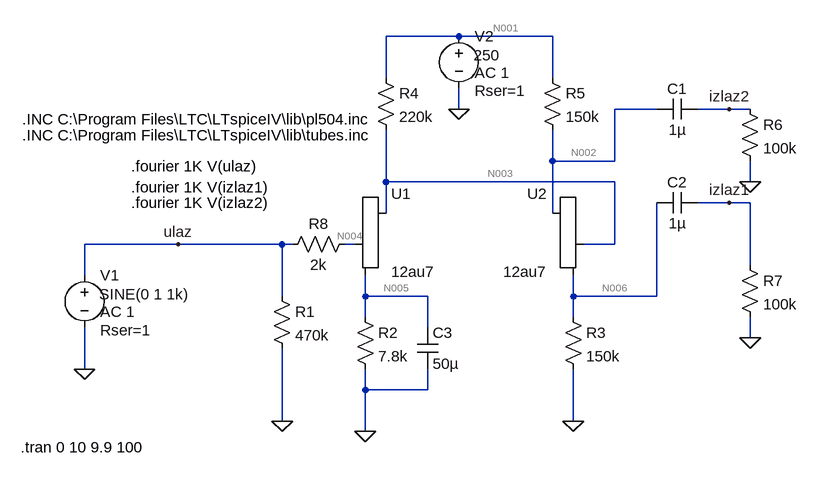
[diagram p0: schematic paraprase.asc]
paraprase.asc, the LTspice schematic file:
Version 4
SHEET 1 880 680
WIRE 240 -144 128 -144
WIRE 384 -144 240 -144
WIRE 128 -80 128 -144
WIRE 384 -80 384 -144
WIRE 240 -32 240 -64
WIRE 544 -32 480 -32
WIRE 656 -32 608 -32
WIRE 688 -32 656 -32
WIRE 384 48 384 0
WIRE 480 48 480 -32
WIRE 480 48 384 48
WIRE 128 80 128 0
WIRE 480 80 128 80
WIRE 688 80 688 48
WIRE 656 112 608 112
WIRE 688 112 656 112
WIRE 128 128 128 80
WIRE 384 128 384 48
WIRE -192 176 -336 176
WIRE -32 176 -192 176
WIRE -16 176 -32 176
WIRE 80 176 64 176
WIRE 480 176 480 80
WIRE 480 176 432 176
WIRE 688 208 688 112
WIRE -336 224 -336 176
WIRE -32 256 -32 176
WIRE 96 256 96 224
WIRE 192 256 96 256
WIRE 416 256 416 224
WIRE 544 256 544 112
WIRE 544 256 416 256
WIRE 96 288 96 256
WIRE 416 288 416 256
WIRE 192 304 192 256
WIRE 688 320 688 288
WIRE -336 368 -336 304
WIRE 96 400 96 368
WIRE 192 400 192 368
WIRE 192 400 96 400
WIRE -32 448 -32 336
WIRE 416 448 416 368
WIRE 96 464 96 400
FLAG -336 368 0
FLAG -32 448 0
FLAG 96 464 0
FLAG 240 -32 0
FLAG 688 320 0
FLAG 688 80 0
FLAG -192 176 ulaz
FLAG 656 -32 izlaz2
FLAG 656 112 izlaz1
FLAG 416 448 0
SYMBOL Misc\\triode 128 176 R0
SYMATTR InstName U1
SYMATTR Value 12au7
SYMBOL Misc\\triode 384 176 M0
SYMATTR InstName U2
SYMATTR Value 12au7
SYMBOL voltage -336 208 R0
WINDOW 3 23 45 Left 2
WINDOW 123 24 72 Left 2
WINDOW 39 24 100 Left 2
SYMATTR Value SINE(0 1 1k)
SYMATTR Value2 AC 1
SYMATTR SpiceLine Rser=1
SYMATTR InstName V1
SYMBOL res -48 240 R0
SYMATTR InstName R1
SYMATTR Value 470k
SYMBOL res 112 -96 R0
SYMATTR InstName R4
SYMATTR Value 220k
SYMBOL res 368 -96 R0
SYMATTR InstName R5
SYMATTR Value 150k
SYMBOL res 672 -48 R0
SYMATTR InstName R6
SYMATTR Value 100k
SYMBOL res 672 192 R0
SYMATTR InstName R7
SYMATTR Value 100k
SYMBOL res 80 160 R90
WINDOW 0 0 56 VBottom 2
WINDOW 3 32 56 VTop 2
SYMATTR InstName R8
SYMATTR Value 2k
SYMBOL voltage 240 -160 R0
WINDOW 3 23 45 Left 2
WINDOW 123 24 72 Left 2
WINDOW 39 24 100 Left 2
SYMATTR Value 250
SYMATTR Value2 AC 1
SYMATTR SpiceLine Rser=1
SYMATTR InstName V2
SYMBOL cap 608 -48 R90
WINDOW 0 0 32 VBottom 2
WINDOW 3 32 32 VTop 2
SYMATTR InstName C1
SYMATTR Value 1µ
SYMBOL cap 608 96 R90
WINDOW 0 0 32 VBottom 2
WINDOW 3 32 32 VTop 2
SYMATTR InstName C2
SYMATTR Value 1µ
SYMBOL res 80 272 R0
SYMATTR InstName R2
SYMATTR Value 7.8k
SYMBOL cap 176 304 R0
SYMATTR InstName C3
SYMATTR Value 50µ
SYMBOL res 400 272 R0
SYMATTR InstName R3
SYMATTR Value 150k
TEXT -432 -16 Left 2 !.INC C:\\Program Files\\LTC\\LTspiceIV\\lib\\pl504.inc
TEXT -432 8 Left 2 !.INC C:\\Program Files\\LTC\\LTspiceIV\\lib\\tubes.inc
TEXT -264 56 Left 2 !.fourier 1K V(ulaz)
TEXT -434 488 Left 2 !.tran 0 10 9.9 100
TEXT -264 88 Left 2 !.fourier 1K V(izlaz1)
TEXT -264 112 Left 2 !.fourier 1K V(izlaz2)

The netlist it stands for:
* paraprase.asc
XU1 N003 N004 N005 12au7
XU2 N002 N003 N006 12au7
V1 ulaz 0 SINE(0 1 1k) AC 1 Rser=1
R1 ulaz 0 470k
R4 N001 N003 220k
R5 N001 N002 150k
R6 izlaz2 0 100k
R7 izlaz1 0 100k
R8 N004 ulaz 2k
V2 N001 0 250 AC 1 Rser=1
C1 izlaz2 N002 1µ
C2 izlaz1 N006 1µ
R2 N005 0 7.8k
C3 N005 0 50µ
R3 N006 0 150k
.INC C:\Program Files\LTC\LTspiceIV\lib\pl504.inc
.INC C:\Program Files\LTC\LTspiceIV\lib\tubes.inc
.fourier 1K V(ulaz)
.tran 0 10 9.9 100
.fourier 1K V(izlaz1)
.fourier 1K V(izlaz2)
.backanno
.end

* Results of the author's LTspice run, read from the files saved beside the schematic
* Operating Point, zero values left out:
*   V(n003) = 97.41 V
*   V(n005) = 5.41 V
*   V(n004) = 2.012 µV
*   V(n002) = 149.9 V
*   V(n006) = 100.1 V
*   V(n001) = 250 V
*   I(R3) = 667 µA
*   I(R2) = 693.6 µA
*   I(R8) = 1.005 nA
*   I(R5) = 667 µA
*   I(R4) = 693.6 µA
*   I(V2) = -1.361 mA
*   I(V1) = 1.005 nA
*   Ix(u1:1) = 693.6 µA
*   Ix(u1:2) = -1.005 nA
*   Ix(u1:3) = -693.6 µA
*   Ix(u2:1) = 667 µA
*   Ix(u2:2) = -1.003 nA
*   Ix(u2:3) = -667 µA
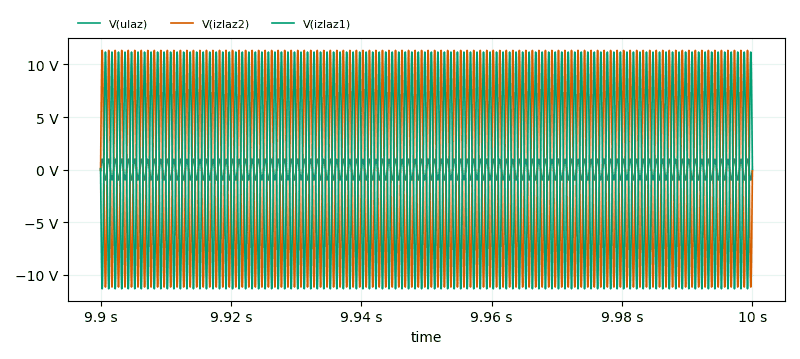
[diagram p1: Transient Analysis of paraprase.asc, plotted from the saved traces]
* Transient Analysis, 1 run:
*   V(ulaz): min -997.2 mV, max 997 mV, average 571.4 µV, rms 702.9 mV, last -244 nV
*   V(izlaz2): min -11.18 V, max 11.34 V, average 10.32 mV, rms 7.941 V, last -109.4 mV
*   V(izlaz1): min -11.34 V, max 11.18 V, average -10.3 mV, rms 7.941 V, last 85.48 mV
* From the log:
*   N-Period=1
*   Fourier components of V(ulaz)
*   DC component:0.000251724
*   Harmonic  Frequency   Fourier   Normalized   Phase    Normalized
*    Number     [Hz]     Component   Component  [degree]  Phase [deg]
*       1     1.000e+03  9.751e-01  1.000e+00      0.30°      0.00°
*       2     2.000e+03  1.416e-03  1.452e-03    -16.68°    -16.98°
*       3     3.000e+03  2.184e-02  2.240e-02   -168.01°   -168.31°
*       4     4.000e+03  1.203e-03  1.234e-03    -59.58°    -59.88°
*       5     5.000e+03  5.174e-04  5.306e-04     48.97°     48.67°
*       6     6.000e+03  2.009e-04  2.060e-04    -92.39°    -92.69°
*       7     7.000e+03  8.668e-04  8.889e-04     -7.66°     -7.97°
*       8     8.000e+03  3.084e-05  3.163e-05     -2.98°     -3.28°
*       9     9.000e+03  1.714e-03  1.758e-03    -65.61°    -65.91°
*   Total Harmonic Distortion: 2.257516%(2.279495%)
*   N-Period=1
*   Fourier components of V(izlaz1)
*   DC component:-0.00541149
*   Harmonic  Frequency   Fourier   Normalized   Phase    Normalized
*    Number     [Hz]     Component   Component  [degree]  Phase [deg]
*       1     1.000e+03  1.102e+01  1.000e+00   -179.69°      0.00°
*       2     2.000e+03  7.937e-02  7.205e-03    101.86°    281.55°
*       3     3.000e+03  2.445e-01  2.219e-02     12.26°    191.95°
*       4     4.000e+03  1.016e-02  9.218e-04    133.32°    313.01°
*       5     5.000e+03  6.756e-03  6.133e-04   -141.25°     38.44°
*       6     6.000e+03  4.634e-03  4.206e-04    110.35°    290.04°
*       7     7.000e+03  1.148e-02  1.042e-03    172.66°    352.35°
*       8     8.000e+03  1.774e-03  1.611e-04    170.40°    350.09°
*       9     9.000e+03  2.017e-02  1.831e-03    116.99°    296.67°
*   Total Harmonic Distortion: 2.345813%(2.367481%)
*   N-Period=1
*   Fourier components of V(izlaz2)
*   DC component:0.0053716
*   Harmonic  Frequency   Fourier   Normalized   Phase    Normalized
*    Number     [Hz]     Component   Component  [degree]  Phase [deg]
*       1     1.000e+03  1.102e+01  1.000e+00      0.19°      0.00°
*       2     2.000e+03  7.932e-02  7.200e-03    -78.42°    -78.61°
*       3     3.000e+03  2.444e-01  2.219e-02   -167.82°   -168.00°
*       4     4.000e+03  1.022e-02  9.279e-04    -46.11°    -46.30°
*       5     5.000e+03  6.735e-03  6.113e-04     37.40°     37.22°
*       6     6.000e+03  4.656e-03  4.226e-04    -68.47°    -68.66°
*       7     7.000e+03  1.155e-02  1.048e-03     -7.58°     -7.77°
*       8     8.000e+03  1.851e-03  1.680e-04     -8.87°     -9.06°
*       9     9.000e+03  2.022e-02  1.836e-03    -62.76°    -62.95°
*   Total Harmonic Distortion: 2.345471%(2.367234%)